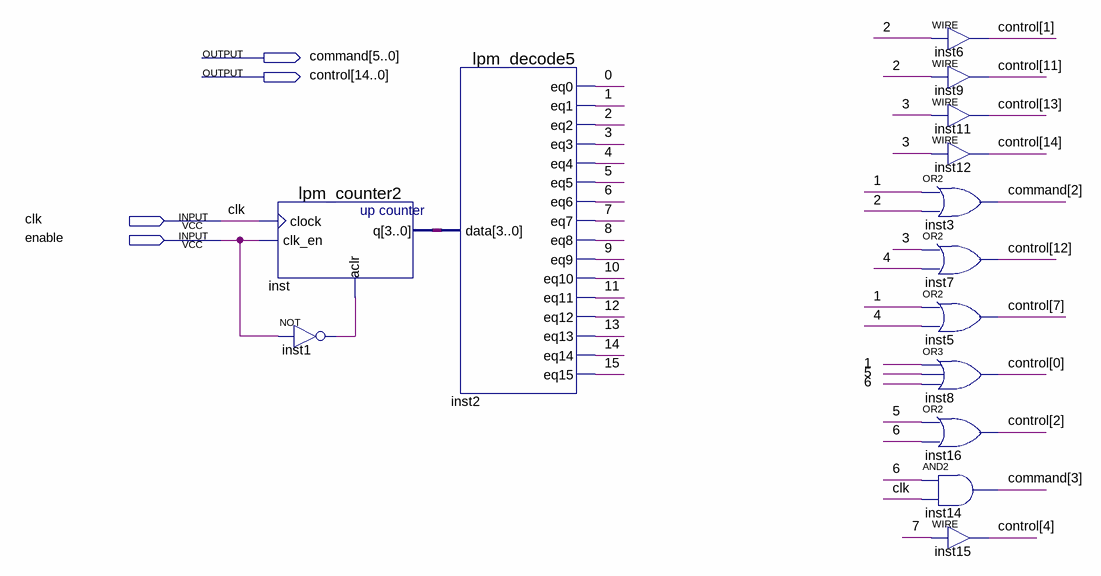
[diagram p0: schematic sheet]
// Quartus schematic addc1.bdf as structural Verilog: 14 symbols, 4 pins
module addc1 (
  input  clk,
  input  enable,
  output [5:0] command,
  output [14:0] control
);

  wire \0 , \1 , \2 , \3 , \4 , \5 , \6 , \7 , \8 , \9 , \10 , \11 , \12 , \13 , \14 , \15 , inst1_out;
  wire [3:0] inst_q;

  lpm_counter2 inst (.clock(clk), .clk_en(enable), .aclr(inst1_out), .q(inst_q));
  not inst1 (inst1_out, enable);
  lpm_decode5 inst2 (
    .data(inst_q), .eq0(\0 ), .eq1(\1 ), .eq2(\2 ), .eq3(\3 ), .eq4(\4 ), .eq5(\5 ), .eq6(\6 ), .eq7(\7 ),
    .eq8(\8 ), .eq9(\9 ), .eq10(\10 ), .eq11(\11 ), .eq12(\12 ), .eq13(\13 ), .eq14(\14 ), .eq15(\15 ));
  assign control[1] = \2 ;  // WIRE inst6
  assign control[11] = \2 ;  // WIRE inst9
  assign control[13] = \3 ;  // WIRE inst11
  assign control[14] = \3 ;  // WIRE inst12
  or inst3 (command[2], \1 , \2 );
  or inst7 (control[12], \3 , \4 );
  or inst5 (control[7], \1 , \4 );
  or inst8 (control[0], \1 , \5 , \6 );
  or inst16 (control[2], \5 , \6 );
  and inst14 (command[3], \6 , clk);
  assign control[4] = \7 ;  // WIRE inst15
endmodule
